# Altium schematic sheet LINK_Filter.SchDoc
size A
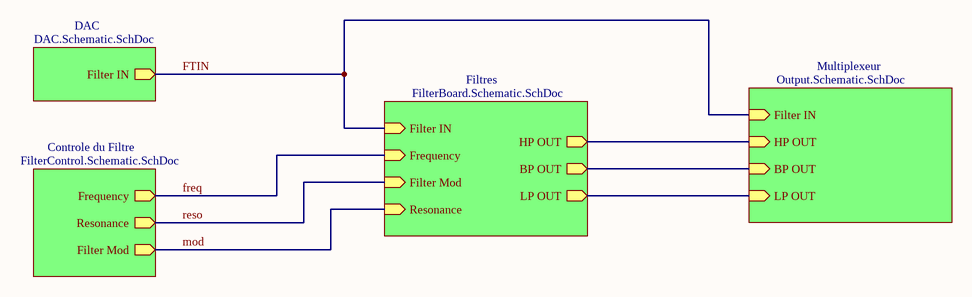
[diagram p0: LINK_Filter.SchDoc]

## Sub-sheets
Controle du Filtre = FilterControl.Schematic.SchDoc: Frequency (out), Resonance (out), Filter Mod (out)
DAC = DAC.Schematic.SchDoc: Filter IN (out)
Filtres = FilterBoard.Schematic.SchDoc: Filter IN (in), Filter Mod (in), Frequency (in), Resonance (in), BP OUT (out), HP OUT (out), LP OUT (out)
Multiplexeur = Output.Schematic.SchDoc: Filter IN (in), BP OUT (in), HP OUT (in), LP OUT (in)

## Nets
freq: sheet Filtres/Frequency, sheet Controle du Filtre/Frequency
FTIN: sheet Filtres/Filter IN, sheet DAC/Filter IN, sheet Multiplexeur/Filter IN
mod: sheet Filtres/Resonance, sheet Controle du Filtre/Filter Mod
reso: sheet Filtres/Filter Mod, sheet Controle du Filtre/Resonance
(unnamed): sheet Filtres/BP OUT, sheet Multiplexeur/BP OUT
(unnamed): sheet Filtres/HP OUT, sheet Multiplexeur/HP OUT
(unnamed): sheet Filtres/LP OUT, sheet Multiplexeur/LP OUT